# EAGLE design AstroEQ SMD V4.8 (EAGLE 6.6.0)
REVISION: V4.8
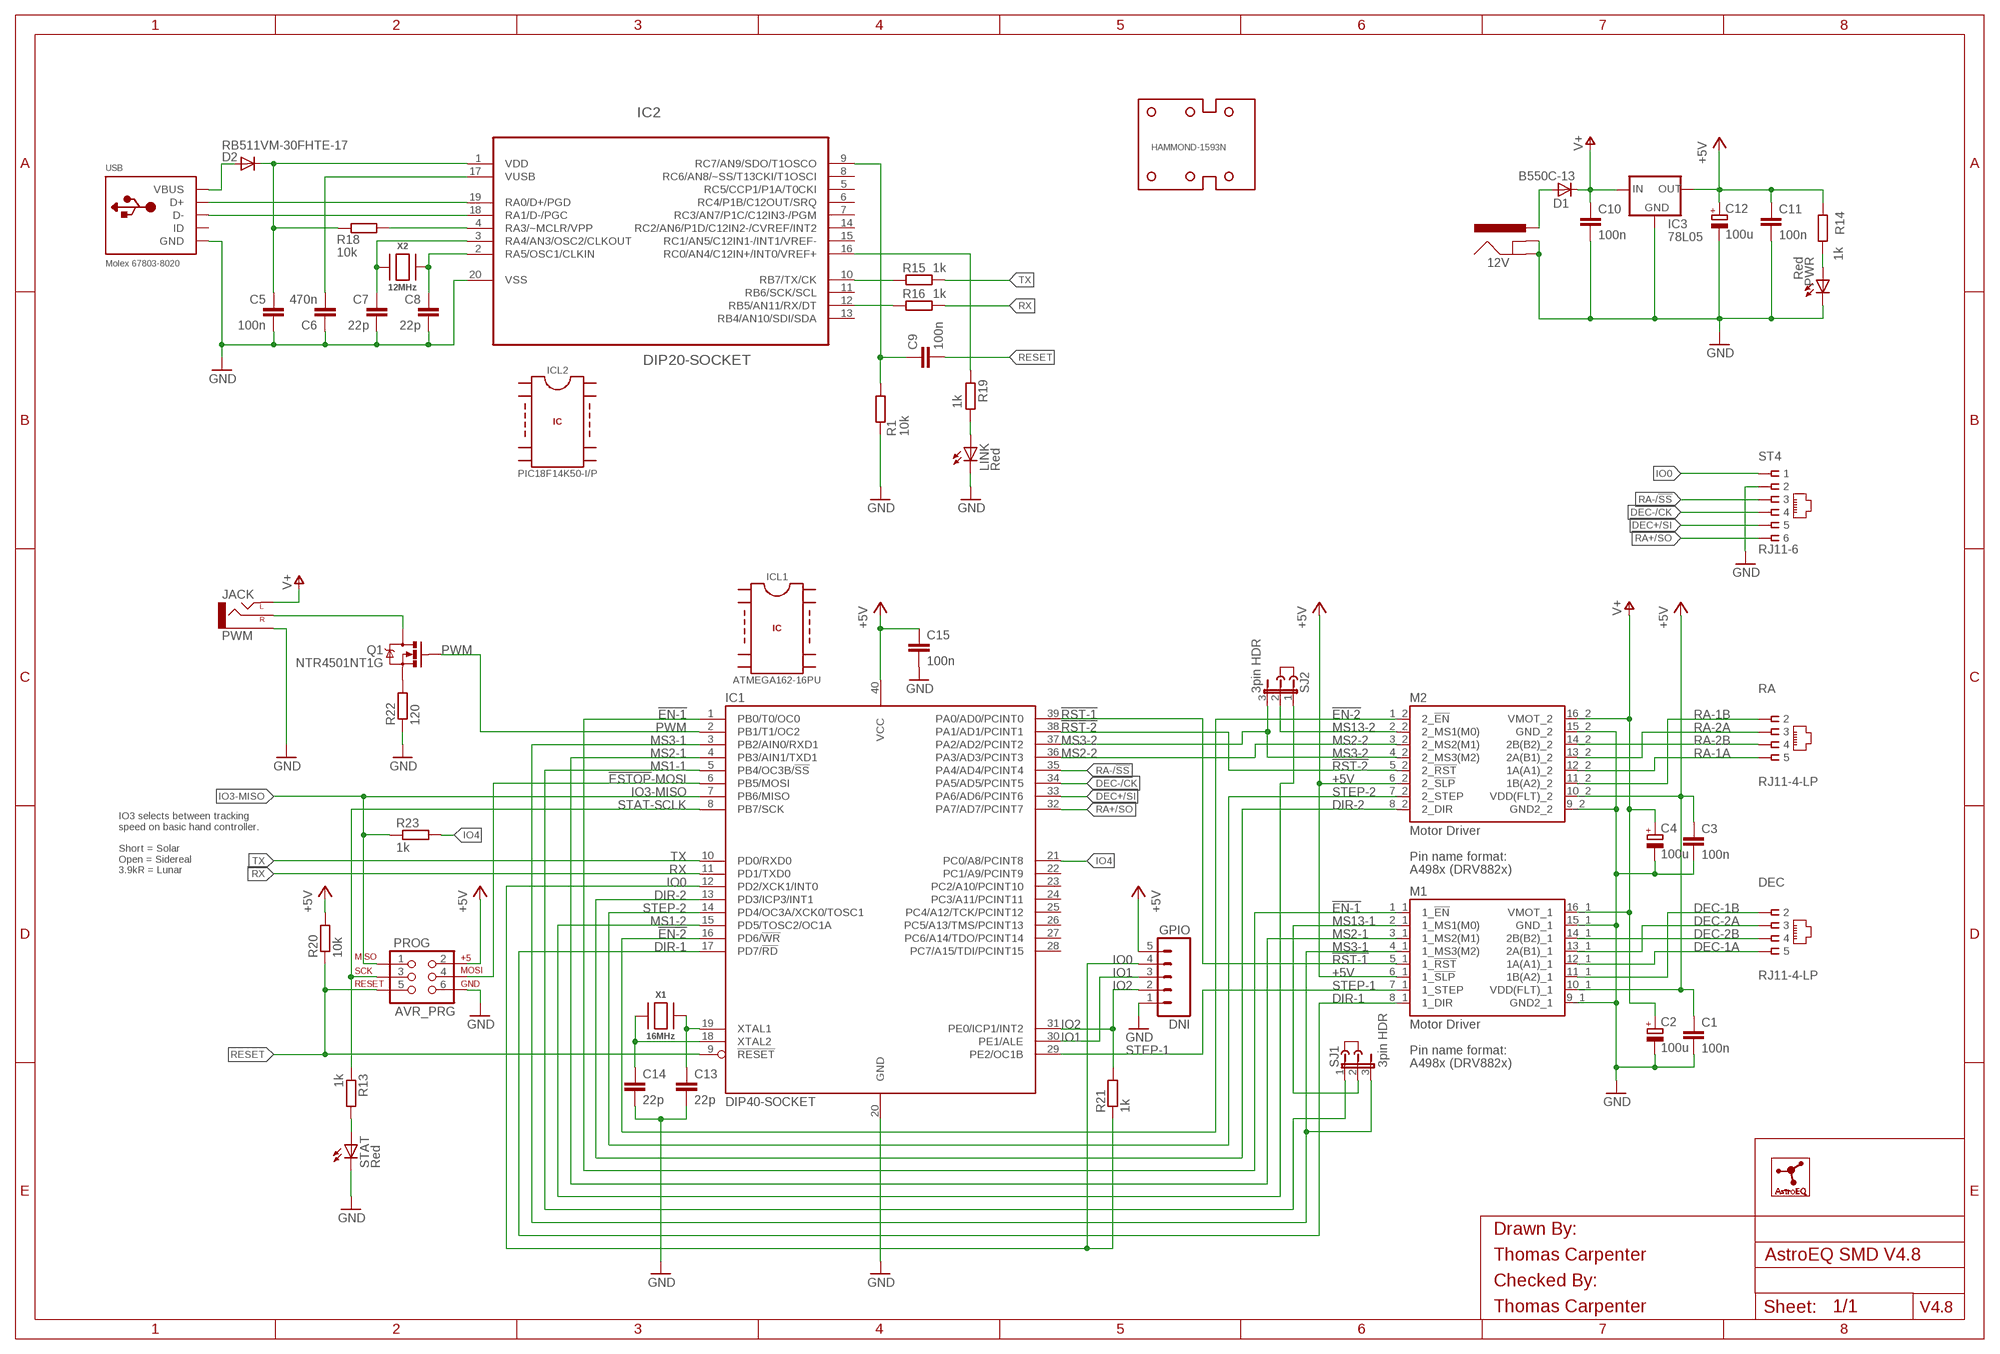
[diagram p0: schematic, sheet 1]
FRAME1 (A3L-LOC): CHECKED_BY: Thomas Carpenter; DRAWN_BY: Thomas Carpenter

## Parts
12V  POWER_JACKPTH  [POWER_JACK_PTH]
C1  100n  C-EUC0603  [C0603]
C2  100u  CPOL-EUD  [PANASONIC_D]
C3  100n  C-EUC0603  [C0603]
C4  100u  CPOL-EUD  [PANASONIC_D]
C5  100n  C-EUC0603  [C0603]
C6  470n  C-EUC0603  [C0603]
C7  22p  C-EUC0603  [C0603]
C8  22p  C-EUC0603  [C0603]
C9  100n  C-EUC0603  [C0603]
C10  100n  C-EUC0603  [C0603]
C11  100n  C-EUC0603  [C0603]
C12  100u  CPOL-EUD  [PANASONIC_D]
C13  22p  C-EUC0603  [C0603]
C14  22p  C-EUC0603  [C0603]
C15  100n  C-EUC0603  [C0603]
D1  B550C-13  DIODE-SMC  [SMC]
D2  RB511VM-30FHTE-17  DIODESOD  [SOD-323]
DEC  RJ11-4-LP  [RJ11-NO_SHIELD-4-LP]
GPIO  DNI  M05PTH  [1X05]
HAMMOND-1593N  HAMMOND-1593N-4HOLE  [HAMMOND-1593N4HOLES]
IC1  DIP40-SOCKET  ATMEGA162-16PU  [DIL40]
IC2  DIP20-SOCKET  PIC18F14K50-I/P-SKT  [DIL20-SKT]
IC3  78L05  V_REG_78XX-SOT89  [SOT89]
ICL1  ATMEGA162-16PU  IC  [IC]
ICL2  PIC18F14K50-I/P  IC  [IC]
J2  DNI  JUMPER  [JUMP]
J3  DNI  JUMPER  [JUMP]
LINK  Red  LED-1206-SIDE  [SML1206-SIDE]
LOGO1  DNI  ASTROEQ5MM  [ASTROEQ-SMALL]
M1  Motor Driver  A4983-DUAL-HV  [CARRIER-HV-DUAL]
M2  Motor Driver  A4983-DUAL-LV  [CARRIER-LV-DUAL]
PROG  AVR_PRG  AVR_SPI_PRG_6PTH  [2X3]
PWM  JACK  AUDIO-JACKPTH  [AUDIO-JACK]
PWR  Red  LED-1206-SIDE  [SML1206-SIDE]
Q1  NTR4501NT1G  MOSFET-NCHANNELSMD  [SOT23-3]
R1  10k  R-EU_R0603  [R0603]
R13  1k  R-EU_R0603  [R0603]
R14  1k  R-EU_R0603  [R0603]
R15  1k  R-EU_R0603  [R0603]
R16  1k  R-EU_R0603  [R0603]
R18  10k  R-EU_R0603  [R0603]
R19  1k  R-EU_R0603  [R0603]
R20  10k  R-EU_R0603  [R0603]
R21  1k  R-EU_R0603  [R0603]
R22  120  R-EU_R0805  [R0805]
R23  1k  R-EU_R0603  [R0603]
RA  RJ11-4-LP  [RJ11-NO_SHIELD-4-LP]
SJ1  3pin HDR  JP2E  [JP2]
SJ2  3pin HDR  JP2E  [JP2]
ST4  RJ11-6  RJ11-LP  [RJ11-NO_SHIELD-LP]
STAT  Red  LED-1206-SIDE  [SML1206-SIDE]
USB  Molex 67803-8020  USBMINIAB  [USB-MINIAB]
X1  16MHz  XTALNX5032  [NX5032]
X2  12MHz  XTALNX5032  [NX5032]

## Nets
!EN-1: IC1.1(PB0/T0/OC0) M2.1_1(1_!EN)
!EN-2: IC1.16(PD6/!WR) M2.1_2(2_!EN)
!ESTOP!-MOSI: IC1.6(PB5/MOSI) PROG.4
!RST-1: IC1.39(PA0/AD0/PCINT0) M2.5_1(1_!RST)
!RST-2: IC1.38(PA1/AD1/PCINT1) M2.5_2(2_!RST)
+5V: C1.1 C3.1 C11.1 C12.+ C15.1 GPIO.5 IC1.40(VCC) IC3.1(OUT) M1.10_1(VDD(FLT)_1) M1.10_2(VDD(FLT)_2) M2.6_1(1_!SLP) M2.6_2(2_!SLP) PROG.2 R14.1 R20.2
AVROSC1: C13.1 IC1.19(XTAL1) X1.P$2
AVROSC2: C14.1 IC1.18(XTAL2) X1.P$1
D_N [usbdat]: IC2.18(RA1/D-/PGC) USB.D-
D_P [usbdat]: IC2.19(RA0/D+/PGD) USB.D+
DEC+/SI: IC1.33(PA6/AD6/PCINT6) ST4.5
DEC-1A: DEC.5 M1.12_1(1A(A1)_1)
DEC-1B: DEC.2 M1.11_1(1B(A2)_1)
DEC-2A: DEC.3 M1.13_1(2A(B1)_1)
DEC-2B: DEC.4 M1.14_1(2B(B2)_1)
DEC-/CK: IC1.34(PA5/AD5/PCINT5) ST4.4
DIR-1: IC1.17(PD7/!RD) M2.8_1(1_DIR)
DIR-2: IC1.13(PD3/ICP3/INT1) M2.8_2(2_DIR)
DTR: C9.1 IC2.9(RC7/AN9/SDO/T1OSCO) R1.1
GND: 12V.GND 12V.GNDBREAK C1.2 C2.- C3.2 C4.- C5.2 C6.1 C7.2 C8.2 C10.2 C11.2 C12.- C13.2 C14.2 C15.2 GPIO.1 IC1.20(GND) IC2.20(VSS) IC3.2(GND) IC3.4(GND) LINK.C LINK.E(C) M1.9_1(GND2_1) M1.9_2(GND2_2) M1.15_1(GND_1) M1.15_2(GND_2) PROG.6 PWM.SLEEVE PWR.C PWR.E(C) R1.2 R22.1 ST4.2 STAT.C STAT.E(C) USB.GND USB.GND1(GND) USB.GND2(GND) USB.GND3(GND) USB.GND4(GND)
IO0: GPIO.4 IC1.12(PD2/XCK1/INT0) R21.1 ST4.1
IO1: GPIO.3 IC1.30(PE1/ALE)
IO2: GPIO.2 IC1.31(PE0/ICP1/INT2) R21.2
IO3-MISO: IC1.7(PB6/MISO) PROG.1 R23.1
IO4: IC1.21(PC0/A8/PCINT8) R23.2
MCLR: IC2.4(RA3/~MCLR/VPP) R18.1
MS1-1: IC1.5(PB4/OC3B/!SS) SJ1.1
MS1-2: IC1.15(PD5/TOSC2/OC1A) SJ2.1
MS2-1: IC1.4(PB3/AIN1/TXD1) M2.3_1(1_MS2(M1))
MS2-2: IC1.36(PA3/AD3/PCINT3) M2.3_2(2_MS2(M1))
MS3-1: IC1.3(PB2/AIN0/RXD1) M2.4_1(1_MS3(M2)) SJ1.3
MS3-2: IC1.37(PA2/AD2/PCINT2) M2.4_2(2_MS3(M2)) SJ2.3
MS13-1: M2.2_1(1_MS1(M0)) SJ1.2
MS13-2: M2.2_2(2_MS1(M0)) SJ2.2
PWM: IC1.2(PB1/T1/OC2) Q1.1(G)
PWM-ILIM: Q1.2(S) R22.2
PWM-OD: PWM.RING(RIGHT) Q1.3(D)
PWRLED: PWR.A R14.2
RA+/SO: IC1.32(PA7/AD7/PCINT7) ST4.6
RA-1A: M1.12_2(1A(A1)_2) RA.5
RA-1B: M1.11_2(1B(A2)_2) RA.2
RA-2A: M1.13_2(2A(B1)_2) RA.3
RA-2B: M1.14_2(2B(B2)_2) RA.4
RA-/!SS: IC1.35(PA4/AD4/PCINT4) ST4.3
RESET: C9.2 IC1.9(!RESET) PROG.5 R20.1
RX: IC1.11(PD1/TXD0) R16.1
RX(USB): IC2.12(RB5/AN11/RX/DT) R16.2
STAT-SCLK: IC1.8(PB7/SCK) PROG.3 R13.1
STATLED: R13.2 STAT.A
STEP-1: IC1.29(PE2/OC1B) M2.7_1(1_STEP)
STEP-2: IC1.14(PD4/OC3A/XCK0/TOSC1) M2.7_2(2_STEP)
TX: IC1.10(PD0/RXD0) R15.1
TX(USB): IC2.10(RB7/TX/CK) R15.2
USBLED: LINK.A R19.1
USBOSC1: C8.1 IC2.2(RA5/OSC1/CLKIN) X2.P$2
USBOSC2: C7.1 IC2.3(RA4/AN3/OSC2/CLKOUT) X2.P$1
USBSTAT: IC2.16(RC0/AN4/C12IN+/INT0/VREF+) R19.2
V+: C2.+ C4.+ C10.1 D1.C IC3.3(IN) M1.16_1(VMOT_1) M1.16_2(VMOT_2) PWM.TIP(LEFT)
VBUS: D2.2(A) USB.VBUS
VIN: 12V.PWR D1.A
VPIC: C5.1 D2.1(C) IC2.1(VDD) R18.2
VUSB: C6.2 IC2.17(VUSB)
Unconnected: IC1.22(PC1/A9/PCINT9) IC1.23(PC2/A10/PCINT10) IC1.24(PC3/A11/PCINT11) IC1.25(PC4/A12/TCK/PCINT12) IC1.26(PC5/A13/TMS/PCINT13) IC1.27(PC6/A14/TDO/PCINT14) IC1.28(PC7/A15/TDI/PCINT15) IC2.5(RC5/CCP1/P1A/T0CKI) IC2.6(RC4/P1B/C12OUT/SRQ) IC2.7(RC3/AN7/P1C/C12IN3-/PGM) IC2.8(RC6/AN8/~SS/T13CKI/T1OSCI) IC2.11(RB6/SCK/SCL) IC2.13(RB4/AN10/SDI/SDA) IC2.14(RC2/AN6/P1D/C12IN2-/CVREF/INT2) IC2.15(RC1/AN5/C12IN1-/INT1/VREF-) USB.ID

## Notes on the sheet
- IO3 selects between tracking
  speed on basic hand controller.
  
  Short = Solar
  Open = Sidereal
  3.9kR = Lunar

## Library data of the parts
12V = SparkFun:POWER_JACK: Power Jack This is the standard 5.5mm barrel jack for power. The PTH is the most common, proven, reliable, footprint. All others are experimental. The Slot footprint only works if the mill layer is transmitted to the PCB fab house so be warned. Spark Fun Electronics SKU : PRT-00119. Mating wall wart : TOL-00298 (and others); MF: MULTICOMP; MPN: MJ-179PH; OC_FARNELL: 1737246
C1 C3 C5 C9-C11 C15 = rcl:C-EU: CAPACITOR, European symbol; MF: MULTICOMP; MPN: MC0603F104Z250CT; OC_FARNELL: 1759038
C2 C4 C12 = rcl:CPOL-EU: POLARIZED CAPACITOR, European symbol; MF: WURTH ELEKTRONIK; MPN: 865080545012; OC_FARNELL: 2466321
C6 = rcl:C-EU: CAPACITOR, European symbol; MF: MULTICOMP; MPN: MC0603F474Z160CT; OC_FARNELL: 1759021
C7 C8 C13 C14 = rcl:C-EU: CAPACITOR, European symbol; MF: MULTICOMP; MPN: MC0603N220J500CT; OC_FARNELL: 1759057
D1 = diode:DIODE-: DIODE; MF: DIODES INC.; MPN: B550C-13-F; OC_FARNELL: 1858608
D2 = SparkFun:DIODE: Diode These are standard reverse protection diodes and small signal diodes. SMA package can handle up to about 1A. SOD-323 can handle about 200mA. What the SOD-323 package when ordering, there are some mfgs out there that are 5-pin packages.; MF: ROHM; MPN: RB511VM-30FHTE-17; OC_FARNELL: 2581544
DEC RA = con-tycoelectronics:RJ11-4; MF: MOLEX; MPN: 95501-2641; OC_FARNELL: 1560166
GPIO = SparkFun:M05: Header 5 Standard 5-pin 0.1" header. Use with straight break away headers (SKU : PRT-00116), right angle break away headers (PRT-00553), swiss pins (PRT-00743), machine pins (PRT-00117), and female headers (PRT-00115). Molex polarized connector foot print use with SKU : PRT-08230 with associated crimp pins and housings.; OC_FARNELL: unknown
HAMMOND-1593N = holes:HAMMOND-1593N; MF: HAMMOND; MPN: 1593NBK; OC_FARNELL: 9287566
IC1 = atmel:ATMEGA162: 8-bit RISC MICROCONTROLLER 16K Bytes internal flash program memory 1K Bytes internal SRAM Upto 64K Bytes optional external memory space 512 Bytes EEPROM Two 8-bit timers Two 16-bit timers Dual programmable serial USARTs Master/Slave serial SPI interface Source: ATMEGA162_DIP40.lbr; MF: MULTICOMP; MPN: 2227MC-40-06-05-F1; OC_FARNELL: 1103855
IC2 = microchip:PIC18F14K50: USB Flash Microcontrollers; MF: MULTICOMP
IC3 = SparkFun:V_REG_78XX: Voltage Regulator Standard 7805 5V regulator. IGO (Input Ground Output). Spark Fun Electronics SKU : COM-00107; MF: STMICROELECTRONICS; MPN: L78L05ACUTR; OC_FARNELL: 1366573
ICL1 = ic-package:IC; MF: ATMEL; MPN: ATMEGA162-16PU; OC_FARNELL: 9171169
ICL2 = ic-package:IC; MF: MICROCHIP; MPN: PIC18F14K50-I/P; OC_FARNELL: 1648501
J2 J3 = jumper:JUMPER: JUMPER header; MF: 3M; MPN: 969102-0000-DA; OC_FARNELL: 2579814
LINK PWR STAT = led:LED: LED OSRAM: - CHIPLED LG R971, LG N971, LY N971, LG Q971, LY Q971, LO R971, LY R971 LH N974, LH R974 LS Q976, LO Q976, LY Q976 LO Q996 - Hyper CHIPLED LW Q18S LB Q993, LB Q99A, LB R99A - SideLED LS A670, LO A670, LY A670, LG A670, LP A670 LB A673, LV A673, LT A673, LW A673 LH A674 LY A675 LS A676, LA A676, LO A676, LY A676, LW A676 LS A679, LY A679, LG A679 - Hyper Micro SIDELED® LS Y876, LA Y876, LO Y876, LY Y876 LT Y87S - SmartLED LW L88C, LW L88S LB L89C, LB L89S, LG L890 LS L89K, LO L89K, LY L89K LS L896, LA L896, LO L896, LY L896 - TOPLED LS T670, LO T670, LY T670, LG T670, LP T670 LSG T670, LSP T670, LSY T670, LOP T670, LYG T670 LG T671, LOG T671, LSG T671 LB T673, LV T673, LT T673, LW T673 LH T674 LS T676, LA T676, LO T676, LY T676, LB T676, LH T676, LSB T676, LW T676 LB T67C, LV T67C, LT T67C, LS T67K, LO T67K, LY T67K, LW E67C LS E67B, LA E67B, LO E67B, LY E67B, LB E67C, LV E67C, LT E67C LW T67C LS T679, LY T679, LG T679 LS T770, LO T770, LY T770, LG T770, LP T770 LB T773, LV T773, LT T773, LW T773 LH T774 LS E675, LA E675, LY E675, LS T675 LS T776, LA T776, LO T776, LY T776, LB T776 LHGB T686 LT T68C, LB T68C - Hyper Mini TOPLED® LB M676 - Mini TOPLED Santana® LG M470 LS M47K, LO M47K, LY M47K Source: http://www.osram.convergy.de LUXEON: - LUMILED® LXK2-PW12-R00, LXK2-PW12-S00, LXK2-PW14-U00, LXK2-PW14-V00 LXK2-PM12-R00, LXK2-PM12-S00, LXK2-PM14-U00 LXK2-PE12-Q00, LXK2-PE12-R00, LXK2-PE12-S00, LXK2-PE14-T00, LXK2-PE14-U00 LXK2-PB12-K00, LXK2-PB12-L00, LXK2-PB12-M00, LXK2-PB14-N00, LXK2-PB14-P00, LXK2-PB14-Q00 LXK2-PR12-L00, LXK2-PR12-M00, LXK2-PR14-Q00, LXK2-PR14-R00 LXK2-PD12-Q00, LXK2-PD12-R00, LXK2-PD12-S00 LXK2-PH12-R00, LXK2-PH12-S00 LXK2-PL12-P00, LXK2-PL12-Q00, LXK2-PL12-R00 Source: www.luxeon.com KINGBRIGHT: KA-3528ASYC Source: www.kingbright.com; MF: WURTH ELEKTRONIK; MPN: 155124RS73200; OC_FARNELL: 2322101
LOGO1 = CompanyLogos:ASTROEQ; OC_FARNELL: unknown
M1 = A4983Carrier:A4983-DUAL-HV; MF: SAMTEC; MPN: CES-116-01-T-S; OC_FARNELL: 1667522
M2 = A4983Carrier:A4983-DUAL-LV; MF: SAMTEC; MPN: CES-116-01-T-S; OC_FARNELL: 1667522
PROG = SparkFun:AVR_SPI_PRG_6: AVR ISP 6 Pin This is the reduced ISP connector for AVR programming. Common on Arduino. This footprint will take up less PCB space and can be used with a 10-pin to 6-pin adapter such as SKU: BOB-08508; MF: HARWIN; MPN: M20-9980346; OC_FARNELL: 1022231
PWM = SparkFun:AUDIO-JACK: 3.5mm Audio Jack Simple 3.5mm common PCB mount audio jack. SKU: PRT-08032; MF: CLIFF ELECTRONIC COMPONENTS; MPN: FC68131; OC_FARNELL: 2518188
Q1 = SparkFun:MOSFET-NCHANNEL; MF: ON SEMICONDUCTOR; MPN: NTR4501NT1G; OC_FARNELL: 1431305
R1 R18 R20 = rcl:R-EU_: RESISTOR, European symbol; MF: MULTICOMP; MPN: MCWR06X1002FTL; OC_FARNELL: 2447230
R13-R16 R19 R21 R23 = rcl:R-EU_: RESISTOR, European symbol; MF: MULTICOMP; MPN: MCWR06X1001FTL; OC_FARNELL: 2447272
R22 = rcl:R-EU_: RESISTOR, European symbol; MF: MULTICOMP; MPN: MCWR08X1200FTL; OC_FARNELL: 2447561
SJ1 SJ2 = jumper:JP2E: JUMPER; MF: HARWIN; MPN: M20-9990345.; OC_FARNELL: 1022248
ST4 = con-tycoelectronics:RJ11: CORCOM Modular RJ Jacks No Shield Source: www.tycoelectronics.com .. ENG_DS_1654001_1099_RJ_L_0507.pdf; MF: MOLEX; MPN: 95501-2661; OC_FARNELL: 1536490
USB = adafruit:USB: USB Connectors USBMINIB - Surface Mount Female Mini-B USB Connector 4UConnector: 06564 By microbuilder.eu Thru-hole RA Female Mini-B USB Connector 4UConnector: 18732 By ladyada.net; MF: MOLEX; MPN: 67803-8020; OC_FARNELL: 1355761
X1 = adafruit:XTAL: Low cost SMT crystals, no capacitors included http://www.ladyada.net/library/eagle; MF: TXC; MPN: 7A-16.000MAAJ-T; OC_FARNELL: 1841946
X2 = adafruit:XTAL: Low cost SMT crystals, no capacitors included http://www.ladyada.net/library/eagle; MF: TXC; MPN: 7A-12.000MAAJ-T; OC_FARNELL: 1841940

## Net classes
1 power: width 0.61 mm, drill 0.711 mm, clearance 0.203 mm
2 gnd: width 0.305 mm, drill 0.711 mm, clearance 0.203 mm
3 usbvcc: width 0.508 mm, drill 0.711 mm, clearance 0.203 mm
4 usbdat: width 0.406 mm, clearance 0.152 mm

## Board
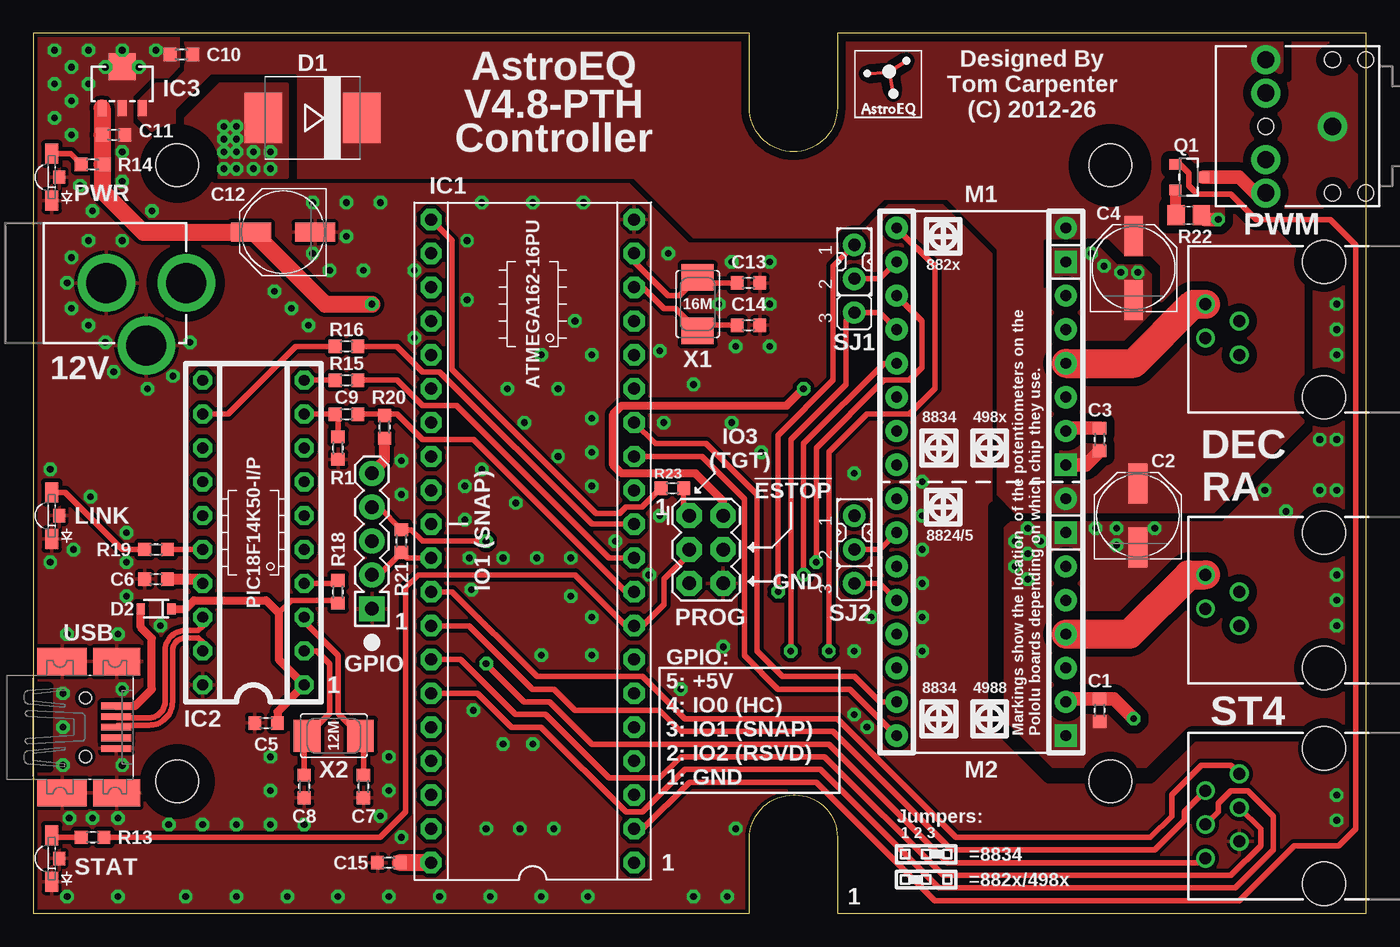
[diagram p1: board, top side]
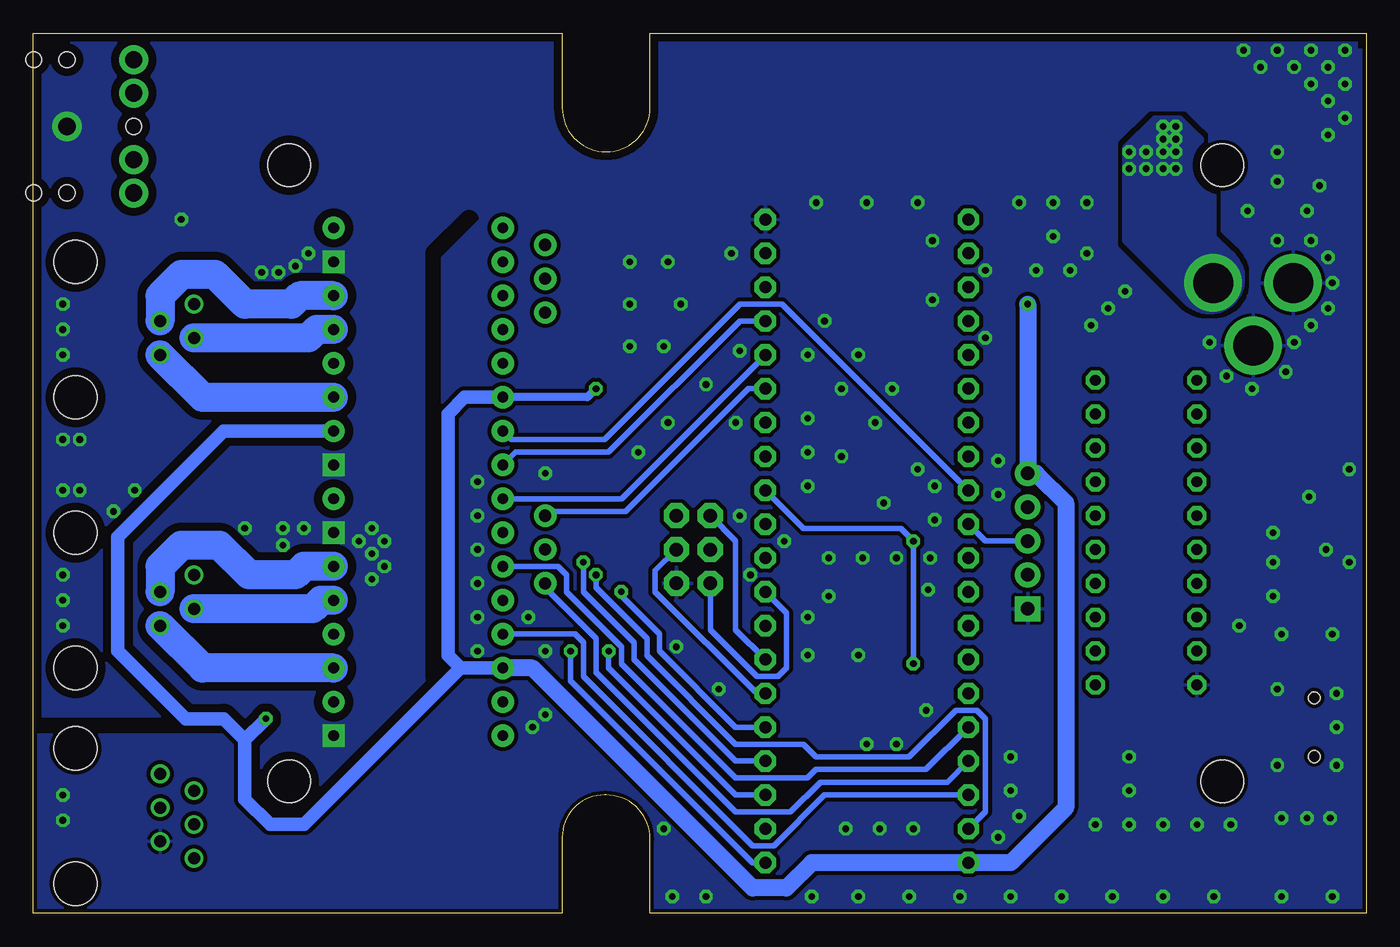
[diagram p2: board, bottom side, seen from below]

Size 100 x 66.04 mm. Coordinates in mm from the lower left corner, seen from the top.
Outline: 57.02,8.89 57.15,8.89
Copper layers (1*16): Top 0.035mm / dielectric 1.5mm / Bottom 0.035mm
Design rules "pcbtrain *": minimum track width 0.2mm, minimum drill 0.4mm, track to track 6mil, track to pad 6mil, pad to pad 6mil, via to via 6mil, smd to smd 0mil, copper to edge 10mil, drill to drill 0.2mm, minimum pad ring 10mil, minimum via ring 10mil, stop-mask expansion 0.125mm, vias tented up to drill 0.75mm, thermal gap 10mil
tKeepout: area 78.3,7.4 to 83.3,12.4; area 78.3,53.6 to 83.3,58.6; area 8.3,7.4 to 13.3,12.4; area 8.3,53.6 to 13.3,58.6
bKeepout: area 78.3,7.4 to 83.3,12.4; area 78.3,53.6 to 83.3,58.6; area 8.3,7.4 to 13.3,12.4; area 8.3,53.6 to 13.3,58.6
tRestrict: area 78.3,53.6 to 83.3,58.6; area 8.3,7.4 to 13.3,12.4; area 8.3,53.6 to 13.3,58.6; area 9,44.8 to 13.9,49.8; 7 lines
bRestrict: 3 lines

### Footprints (pad centres in the part's own frame; a part is rotated, then mirrored left to right if it is on the bottom)
POWER_JACK_PTH = drill 2.997 pad 4.318: GND 0,7.7; GNDBREAK 4.7,10.7; PWR 0,13.7
C0603 = smd 0.95 x 1: 1 -0.85,0; 2 0.85,0
PANASONIC_D = smd 3 x 1.4: + 2.4,0; - -2.4,0
SMC = smd 2.8 x 3.8: A 3.7,0; C -3.7,0
SOD-323 = smd 0.63 x 0.83: 1 -1.15,0; 2 1.15,0
RJ11-NO_SHIELD-4-LP = drill 0.9 pad 1.4: 2 -1.905,6.35; 3 -0.635,8.89; 4 0.635,6.35; 5 1.905,8.89 | hole 3.251: -5.08,0; 5.08,0
1X05 = drill 1.016 pad 1.88 square: 1 -5.08,0 | drill 1.016 pad 1.88: 2 -2.54,0; 3 0,0; 4 2.54,0; 5 5.08,0
HAMMOND-1593N4HOLES = hole 3.2: 10.795,9.906; 10.795,56.134; 80.797,9.906; 80.797,56.134
DIL40 = drill 0.9 pad 1.6 octagon: 1 -24.13,-7.62; 2 -21.59,-7.62; 3 -19.05,-7.62; 4 -16.51,-7.62; 5 -13.97,-7.62; 6 -11.43,-7.62; 7 -8.89,-7.62; 8 -6.35,-7.62; 9 -3.81,-7.62; 10 -1.27,-7.62; 11 1.27,-7.62; 12 3.81,-7.62; 13 6.35,-7.62; 14 8.89,-7.62; 15 11.43,-7.62; 16 13.97,-7.62; 17 16.51,-7.62; 18 19.05,-7.62; 19 21.59,-7.62; 20 24.13,-7.62; 21 24.13,7.62; 22 21.59,7.62; 23 19.05,7.62; 24 16.51,7.62; 25 13.97,7.62; 26 11.43,7.62; 27 8.89,7.62; 28 6.35,7.62; 29 3.81,7.62; 30 1.27,7.62; 31 -1.27,7.62; 32 -3.81,7.62; 33 -6.35,7.62; 34 -8.89,7.62; 35 -11.43,7.62; 36 -13.97,7.62; 37 -16.51,7.62; 38 -19.05,7.62; 39 -21.59,7.62; 40 -24.13,7.62
DIL20-SKT = drill 0.813 pad 1.422 octagon: 1 -3.81,11.43; 2 -3.81,8.89; 3 -3.81,6.35; 4 -3.81,3.81; 5 -3.81,1.27; 6 -3.81,-1.27; 7 -3.81,-3.81; 8 -3.81,-6.35; 9 -3.81,-8.89; 10 -3.81,-11.43; 11 3.81,-11.43; 12 3.81,-8.89; 13 3.81,-6.35; 14 3.81,-3.81; 15 3.81,-1.27; 16 3.81,1.27; 17 3.81,3.81; 18 3.81,6.35; 19 3.81,8.89; 20 3.81,11.43
SOT89 = smd 0.65 x 1.2: 1 -1.5,-1.8; 2 0,-1.8; 3 1.5,-1.8 | smd 2 x 2: 4 0,1.3
SML1206-SIDE = smd 1.5 x 1: A 1.75,0; C -1.75,0 | smd 1 x 0.9: E 0,-0.55
CARRIER-HV-DUAL = drill 0.813 pad 1.676 square: 9_1 -1.27,0; 9_2 19.05,0; 15_1 -16.51,0; 15_2 3.81,0 | drill 0.813 pad 1.676: 10_1 -3.81,0; 10_2 16.51,0; 11_1 -6.35,0; 11_2 13.97,0; 12_1 -8.89,0; 12_2 11.43,0; 13_1 -11.43,0; 13_2 8.89,0; 14_1 -13.97,0; 14_2 6.35,0; 16_1 -19.05,0; 16_2 1.27,0
CARRIER-LV-DUAL = drill 0.813 pad 1.676: 1_1 -19.05,0; 1_2 1.27,0; 2_1 -16.51,0; 2_2 3.81,0; 3_1 -13.97,0; 3_2 6.35,0; 4_1 -11.43,0; 4_2 8.89,0; 5_1 -8.89,0; 5_2 11.43,0; 6_1 -6.35,0; 6_2 13.97,0; 7_1 -3.81,0; 7_2 16.51,0; 8_1 -1.27,0; 8_2 19.05,0
2X3 = drill 1.016 pad 1.88 octagon: 1 -2.54,-1.27; 2 -2.54,1.27; 3 0,-1.27; 4 0,1.27; 5 2.54,-1.27; 6 2.54,1.27
AUDIO-JACK = drill 1.3 pad 2.184: RING 5,5; RSH 5,2.5; SLEEVE 0,0; TIP 5,-5; TSH 5,-2.5 | hole 1.2: 0,5; -2.5,5; -2.5,-5; 0,-5; 5,0
SOT23-3 = smd 0.8 x 0.9: 1 -0.95,-1; 2 0.95,-1; 3 0,1.1
R0603 = smd 0.95 x 1: 1 -0.85,0; 2 0.85,0
R0805 = smd 1.3 x 1.5: 1 -0.95,0; 2 0.95,0
JP2 = drill 0.914 pad 1.676: 1 -2.54,0; 2 0,0; 3 2.54,0
RJ11-NO_SHIELD-LP = drill 0.9 pad 1.4: 1 -3.175,8.89; 2 -1.905,6.35; 3 -0.635,8.89; 4 0.635,6.35; 5 1.905,8.89; 6 3.175,6.35 | hole 3.251: -5.08,0; 5.08,0
USB-MINIAB = smd 0.5 x 2.25: D+ 0,2.225; D- -0.8,2.225; GND 1.6,2.225; ID 0.8,2.225; VBUS -1.6,2.225 | smd 2.05 x 3.7: GND1 -4.925,-1.85; GND4 4.925,-1.85 | smd 2.05 x 3.5: GND2 -4.925,2.25; GND3 4.925,2.25 | hole 0.9: -2.2,-0.1; 2.2,-0.1
NX5032 = smd 2 x 2.4: P$1 2,0; P$2 -2,0

### Placement (x,y rotation side)
12V  -2.22,47.31 270 top
C1  80.01,15.24 270 top
C2  82.87,29.84 90 top
C3  80.01,35.56 270 top
C4  82.55,48.42 90 top
C5  17.46,14.29 180 top
C6  9.21,25.08 0 top
C7  24.77,9.53 270 top
C8  20.32,9.53 270 top
C9  23.5,37.47 0 top
C10  11.11,64.45 180 top
C11  6.03,58.42 0 top
C12  18.73,51.12 180 top
C13  53.66,47.31 0 top
C14  53.66,44.13 0 top
C15  26.67,3.81 180 top
D1  20.95,59.69 180 top
D2  9.21,22.86 180 top
DEC  96.84,43.81 90 top
GPIO  25.4,27.94 90 top
HAMMOND-1593N  0,0 0 top
IC1  37.47,27.94 90 top
IC2  16.51,28.57 180 top
IC3  6.67,62.23 0 top
ICL1  37.47,45.72 180 top
ICL2  16.51,28.57 180 top
J2  61.59,28.57 0 top
J3  61.59,48.9 0 top
LINK  1.38,29.84 90 top
LOGO1  61.59,59.69 0 top
M1  77.47,32.38 270 top
M2  64.77,32.38 270 top
PROG  50.48,27.3 270 top
PWM  97.47,59.05 180 top
PWR  1.38,55.24 90 top
Q1  86.68,55.24 270 top
R1  22.86,34.92 270 top
R13  4.45,5.71 180 top
R14  4.45,56.2 180 top
R15  23.5,40.01 180 top
R16  23.5,42.55 180 top
R18  22.86,24.13 270 top
R19  9.21,27.3 0 top
R20  26.35,36.51 270 top
R21  27.62,27.94 270 top
R22  86.68,52.39 180 top
R23  47.94,31.91 180 top
RA  96.84,23.5 90 top
SJ1  61.59,47.62 270 top
SJ2  61.59,27.3 270 top
ST4  96.84,7.3 90 top
STAT  1.38,4.13 90 top
USB  4,13.97 270 top
X1  49.85,45.72 270 top
X2  22.54,13.34 0 top

### Tracks (layer width: path | path; a pad name or v marks a point on that pad's centre or on a via)
!EN-1  (via drill 0.5)
  Top 0.406: M2.1_1 67.63,48.58 67.63,39.37 65.72,37.47 62.55,37.47 59.69,34.61 v59.69,19.68
  Bottom 0.406: IC1.1 46.04,3.81 59.69,17.46 v59.69,19.68
!EN-2
  Bottom 0.406: M2.1_2 55.88,31.11 IC1.16
!ESTOP!-MOSI
  Bottom 0.406: IC1.6 45.72,16.51 53.34,24.13 53.34,25.72 PROG.4
!RST-1  (via drill 0.5)
  Top 0.406: M2.5_1 63.82,41.27 57.78,35.24 v57.78,25.4
  Bottom 0.406: IC1.39 28.57,7.62 28.57,14.61 29.21,15.24 30.8,15.24 34.29,11.75 41.27,11.75 42.23,12.7 47.31,12.7 53.98,19.37 53.98,20.64 57.78,24.45 v57.78,25.4
!RST-2
  Bottom 0.406: IC1.38 40.64,8.89 44.45,5.08 46.04,5.08 58.74,17.78 58.74,20.32 59.37,20.95 M2.5_2
+5V  (via drill 0.5, 0.5 pad 0.25)
  Top 0.406: R14.1 5.17,56.2 | C11.1 5.17,58.42
  Top 0.6: PROG.2 51.75,30.96
  Top 0.61: 51.75,30.96 49.69,33.02 44.13,33.02 43.5,33.66 43.5,37.47 44.13,38.1 56.52,38.1 v57.78,39.37
  Top 0.813: GPIO.5 26.35,33.97 R20.2
  Top 1.016: M1.10_1 77.69,36.41 C3.1 | M1.10_2 77.69,16.09 C1.1 81.06,16.09 v82.55,14.61
  Top 1.27: IC3.1 5.17,58.42 5.17,56.2 5.17,54.2 8.26,51.12 C12.+ 16.51,51.12 21.91,45.72 v25.4,45.72 | IC1.40 C15.1
  Bottom 0.61: v57.78,39.37 58.42,38.73 M2.6_1
  Bottom 1.016: M1.10_1 85.72,36.2 93.66,28.26 93.66,19.68 88.58,14.61 85.72,14.61 84.14,13.02 | v82.55,14.61 84.14,13.02 | 84.14,13.02 84.14,8.57 82.23,6.67 79.69,6.67 67.94,18.41 | 67.94,18.41 M2.6_2 | 67.94,18.41 68.9,19.37 68.9,37.47 67.63,38.73 M2.6_1
  Bottom 1.27: v25.4,45.72 GPIO.5 24.77,33.02 22.54,30.8 22.54,7.94 26.67,3.81 IC1.40 41.59,3.81 43.5,1.91 46.04,1.91 62.55,18.41 M2.6_2
AVROSC1
  Top 0.406: IC1.19 45.09,48.9 47.62,46.35 48.48,46.35 X1.P$2 50.26,47.31 C13.1
AVROSC2
  Top 0.406: IC1.18 45.72,46.99 47.31,45.4 48.16,45.4 X1.P$1 50.26,44.13 C14.1
D_N
  Top 0.406: IC2.18 12.7,21.55 12.38,21.23 11.43,21.23 arc90 9.88,19.68 9.88,15.88 arc-90 8.69,14.68 6.32,14.68 USB.D-
D_P
  Top 0.406: IC2.19 12.7,20.36 12.38,20.68 11.43,20.68 arc90 10.44,19.68 10.44,15.88 arc-90 8.69,14.12 6.38,14.12 USB.D+
DEC+/SI
  Top 0.406: IC1.33 32.7,21.59 37.47,16.83 39.05,16.83 40.64,15.24 46.99,15.24 48.58,13.65 60.01,13.65 68.9,4.76 84.14,4.76 86.36,6.99 86.36,7.62 ST4.5
DEC-1A
  Top 2.184: M1.12_1 82.55,41.27 87,45.72 DEC.5
DEC-1B
  Bottom 2.184: DEC.2 87.31,38.73 M1.11_1
DEC-2A
  Bottom 2.184: M1.13_1 78.74,43.81 79.38,43.18 DEC.3
DEC-2B
  Bottom 2.184: M1.14_1 80.01,46.35 80.64,45.72 84.14,45.72 86.36,47.94 88.9,47.94 90.49,46.35 DEC.4
DEC-/CK
  Top 0.406: IC1.34 32.07,19.05 36.2,14.92 38.42,14.92 43.18,10.16 46.99,10.16 48.58,11.75 59.37,11.75 68.26,2.86 89.85,2.86 92.08,5.08 92.08,6.35 ST4.4
DIR-1
  Bottom 0.406: IC1.17 46.99,44.45 56.83,34.61 63.82,34.61 M2.8_1
DIR-2
  Top 0.406: M2.8_2 61.28,16.83 55.88,16.83 53.34,19.37 53.34,31.11 50.16,34.29 IC1.13
DTR
  Top 0.406: IC2.9 C9.1 22.86,37.25 R1.1
GND  (via drill 0.5)
  Top 1.016: C3.2 78.95,33.66 M1.9_1 | v88.9,52.07 87.94,52.07 R22.1
  other vias: 6.67,57.15 6.67,54.93 8.89,52.7 1.59,64.77 6.67,64.77 4.13,64.77 1.59,62.23 4.13,62.23 1.59,59.69 2.86,60.96 2.86,63.5 5.4,63.5 4.45,52.7 6.67,50.48 3.49,54.61 7.94,63.5 9.21,64.77 2.86,58.42 79.38,49.53 82.87,48.1 81.6,48.1 80.33,48.58 79.69,28.89 81.28,28.89 84.14,28.89 81.28,27.62 96.52,35.56 97.79,35.56 96.52,31.75 97.79,31.75 97.79,45.72 97.79,41.91 97.79,43.81 97.79,23.5 97.79,21.59 97.79,25.4 97.79,8.89 97.79,6.99 74.61,28.89 74.61,26.99 74.61,25.08 73.66,27.94 73.66,26.04 75.56,27.94 92.39,31.75 93.98,30.16 2.22,16.51 2.22,11.11 2.22,13.97 6.67,16.83 6.67,11.11 2.7,7.14 6.35,7.14 6.35,20.95 2.54,20.95 9.53,21.59 6.99,26.35 6.99,23.81 4.29,31.27 6.99,28.57 1.27,33.34 1.27,26.35 3.02,27.3 2.54,1.27 6.35,1.27 11.43,1.27 15.24,1.27 19.05,1.27 22.86,1.27 26.67,1.27 30.48,1.27 34.29,1.27 38.1,1.27 41.59,1.27 49.53,1.27 52.07,1.27 4.13,50.48 2.86,49.21 2.86,45.4 4.13,44.13 5.4,42.86 11.75,42.86 10.48,40.32 8.57,39.37 6.03,40.64 2.54,47.31 20.64,44.13 19.37,45.4 18.1,46.67 20.95,49.53 22.23,48.26 24.77,48.26 20.95,53.34 23.5,53.34 23.5,50.8 26.04,53.34 33.66,53.34 37.47,53.34 41.27,53.34 47.62,49.53 51.44,45.72 55.24,45.72 55.24,48.9 55.24,42.55 52.7,42.55 52.39,48.9 20.32,6.67 17.78,9.21 17.78,11.75 26.67,11.75 26.67,9.21 27.62,5.71 4.45,7.14 17.78,6.67 15.24,6.67 12.7,6.67 10.16,6.67 26.04,7.3 36.83,36.83 39.37,39.37 35.56,39.37 38.1,41.91 40.64,44.45 41.91,41.91 33.02,15.24 35.24,12.7 37.47,12.7 61.59,14.92 61.59,19.68 62.55,13.97 66.67,19.68 66.67,22.23 66.67,24.77 66.67,27.3 66.67,29.84 66.67,32.38 62.87,22.23 33.97,6.35 36.51,6.35 39.05,6.35 54.61,34.61 52.39,36.83 49.53,39.69 46.99,42.23 61.59,33.02 48.58,16.83 51.75,20 41.91,32.07 41.91,34.61 41.91,37.15 47.31,36.83 32.86,24.29 40.32,23.81 38.1,19.37 41.91,19.37 41.91,22.23 27.62,33.97 27.62,31.43 35.24,26.67 40.32,26.67 32.38,29.53 32.38,32.07 33.66,33.34 36.2,30.8 39.37,34.29 37.78,26.67 32.7,26.67 46.2,25.4 52.7,6.35 28.57,43.18 32.54,46.04 28.57,48.26 32.54,50.48 46.99,29.84 43.66,27.94
  pour Top (isolate 0.305, rank 3): -1.27,66.99 72.07,66.99 72.07,14.29 76.2,10.16 82.55,10.16 87.63,15.24 102.3,15.24 102.3,-0.95 -1.27,-0.95
  pour Bottom (isolate 0.305, rank 3): -1.27,64.77 35.56,64.77 46.99,53.34 65.15,53.34 69.91,48.58 69.85,16.51 80.01,6.35 81.92,6.35 84.14,8.57 84.14,13.02 85.09,13.97 101.66,14.29 101.66,-0.95 -1.27,-0.95
  pour Top (isolate 0.305, rank 3, no thermals): -1.27,67.31 -1.27,57.47 11.43,57.47 11.43,67.31
  pour Top (isolate 0.61, rank 3, no thermals): 71.12,67.31 71.12,9.21 101.6,9.21 101.6,67.31
  pour Top (isolate 0.61, no thermals): 76.52,49.85 80.01,49.85 81.28,48.58 83.19,48.58 83.82,47.94 83.82,41.91 76.52,41.91
  pour Bottom (isolate 0.61, rank 3): -2.54,68.58 -2.54,-2.54 102.87,-2.54 102.87,68.58
  pour Bottom (isolate 0.61, rank 3, no thermals): 71.12,66.04 71.12,7.94 101.6,7.94 101.6,66.04
IO0  (via drill 0.5)
  Top 0.406: GPIO.4 25.93,30.48 R21.1 28.36,28.79 29.21,27.94 v33.97,27.94 | ST4.1 87.63,3.81 68.58,3.81 59.69,12.7 41.91,12.7 38.73,15.88 36.83,15.88 v33.97,18.73
  Bottom 0.406: v33.97,18.73 v33.97,27.94 34.92,28.89 42.23,28.89 IC1.12
IO1
  Bottom 0.406: IC1.30 28.57,27.94 GPIO.3
IO2
  Top 0.406: IC1.31 28.04,26.67 R21.2 25.93,25.4 GPIO.2
IO3-MISO
  Top 0.406: PROG.1 48.79,30.27 R23.1
  Bottom 0.406: IC1.7 47.31,21.27 47.31,27.94 PROG.1
IO4
  Top 0.406: R23.2 45.66,30.48 44.45,30.48 43.97,30 42.23,30 31.43,40.8 31.43,50.48 IC1.21
MCLR
  Top 0.406: IC2.4 22.64,24.77 R18.1
MS1-1  (via drill 0.5)
  Top 0.406: v55.88,24.13 55.88,35.88 60.01,40.01 60.01,48.58 SJ1.1
  Bottom 0.406: IC1.5 47.31,13.97 53.02,19.68 53.02,20.95 55.88,23.81 v55.88,24.13
MS1-2
  Bottom 0.406: SJ2.1 61.28,30.16 55.56,30.16 46.35,39.37 IC1.15
MS2-1  (via drill 0.5)
  Top 0.406: v58.74,26.35 58.74,34.92 63.82,40.01 65.72,40.01 66.67,40.96 66.67,44.45 M2.3_1
  Bottom 0.406: IC1.4 47.31,11.43 54.93,19.05 54.93,20.32 58.74,24.13 v58.74,26.35
MS2-2
  Bottom 0.406: M2.3_2 60.64,26.04 60.01,25.4 60.01,24.13 55.88,20 55.88,18.73 47.31,10.16 41.91,10.16 41.27,10.79 33.02,10.79 IC1.36
MS3-1  (via drill 0.5)
  Top 0.406: M2.4_1 63.5,45.09 SJ1.3 60.96,44.45 60.96,39.69 56.83,35.56 v56.83,19.68
  Bottom 0.406: IC1.3 47.31,8.89 56.83,18.41 v56.83,19.68
MS3-2
  Top 0.406: M2.4_2 63.5,24.77 SJ2.3
  Bottom 0.406: IC1.37 31.43,9.84 40.96,9.84 43.18,7.62 47.31,7.62 57.78,18.1 57.78,20.64 61.59,24.45 SJ2.3
MS13-1
  Top 0.406: M2.2_1 63.5,47.62 SJ1.2
MS13-2
  Top 0.406: M2.2_2 63.5,27.3 SJ2.2
PWM
  Top 0.406: Q1.1 86.05,56.2 86.68,55.56 86.68,54.61 87.31,53.98 89.85,53.98 91.76,52.07 97.31,52.07 99.22,50.16 99.22,6.35 97.95,5.08 94.61,5.08 90.49,0.95 67.63,0.95 58.74,9.84 49.21,9.84 45.72,6.35 IC1.2
PWM-ILIM
  Top 0.406: 85.68,52.44 R22.2
  Top 0.813: Q1.2 85.68,52.44
PWM-OD
  Top 1.016: PWM.RING 91.68,54.05 90.49,55.24 Q1.3
PWRLED
  Top 0.406: PWR.A 2.8,56.99 R14.2
RA+/SO
  Top 0.406: IC1.32 31.43,24.13 37.78,17.78 45.72,17.78 48.9,14.61 60.33,14.61 69.22,5.71 83.82,5.71 85.41,7.3 85.41,8.89 87.63,11.11 89.85,11.11 ST4.6
RA-1A
  Top 2.184: M1.12_2 82.23,20.95 86.68,25.4 RA.5
RA-1B
  Bottom 2.184: M1.11_2 87.31,18.41 RA.2
RA-2A
  Bottom 2.184: M1.13_2 78.42,23.5 79.06,22.86 RA.3
RA-2B
  Bottom 2.184: M1.14_2 79.69,26.04 80.33,25.4 83.82,25.4 86.04,27.62 88.9,27.62 90.49,26.04 RA.4
RA-/!SS
  Top 0.406: IC1.35 33.34,16.51 35.88,13.97 38.1,13.97 44.45,7.62 45.72,7.62 48.9,10.79 59.05,10.79 67.94,1.91 90.17,1.91 93.03,4.76 93.03,7.3 91.12,9.21 89.85,9.21 88.9,8.26 88.9,7.62 ST4.3
RESET
  Top 0.406: C9.2 26.35,37.47 | 26.35,37.47 27.3,37.47 29.21,35.56 33.02,35.56 44.45,24.13 IC1.9 | R20.1 26.35,37.47
  Bottom 0.406: IC1.9 43.5,22.54 43.5,18.41 44.13,17.78 45.72,17.78 49.21,21.27 PROG.5
RX
  Top 0.406: R16.1 27.3,42.55 29.21,40.64 30.48,40.64 41.91,29.21 IC1.11
RX(USB)
  Top 0.406: IC2.12 14.61,37.47 19.68,42.55 R16.2
STAT-SCLK
  Top 0.406: R13.1 26.04,5.71 27.94,7.62 27.94,24.45 28.89,25.4 40.64,25.4 44.45,21.59 IC1.8 45.72,21.59 47.31,23.18 47.31,25.08 49.21,26.99 PROG.3
STATLED
  Top 0.406: STAT.A 1.58,5.88 1.75,5.71 R13.2
STEP-1
  Bottom 0.406: IC1.29 43.81,45.72 46.99,45.72 57.15,35.56 64.14,35.56 M2.7_1
STEP-2
  Top 0.406: IC1.14 46.67,35.24 50.48,35.24 54.29,31.43 54.29,19.68 56.2,17.78 61.59,17.78 63.5,15.88 M2.7_2
TX
  Top 0.406: R15.1 27.3,40.01 29.21,38.1 31.75,38.1 43.18,26.67 IC1.10
TX(USB)
  Top 0.406: IC2.10 R15.2
USBLED
  Top 0.406: LINK.A 2.38,31.59 6.67,27.3 R19.1
USBOSC1
  Top 0.406: IC2.2 21.27,19.68 22.23,18.73 22.23,15.02 X2.P$2 20.32,13.11 C8.1
USBOSC2
  Top 0.406: IC2.3 20.32,21.91 22.86,19.37 22.86,15.02 X2.P$1 24.77,13.11 C7.1
USBSTAT
  Top 0.406: R19.2 IC2.16
V+
  pour Top (isolate 0.61, rank 2, no thermals): 93.66,67.31 11.43,67.31 11.43,63.18 10.48,62.23 9.21,62.23 7.94,60.96 7.94,59.69 12.38,55.24 45.09,55.24 49.53,50.8 60.96,50.8 63.82,53.66 68.58,53.66 72.39,49.85 72.39,31.43 73.66,30.16 88.58,30.16 95.25,36.83 95.25,49.21 91.44,53.02 91.44,60.96 93.66,63.18
VBUS
  Top 0.61: USB.VBUS 7.63,15.57 8.89,16.83 8.89,20.64 8.06,21.47 D2.2
VIN  (via drill 0.5)
  other vias: 15.24,55.88 17.78,55.88 14.29,57.15 15.24,57.15 16.51,55.88 17.78,57.15 15.24,59.05 14.29,58.1 16.51,57.15 15.24,58.1 14.29,55.88 14.29,59.05
  pour Top (isolate 0.61, no thermals): 13.97,62.23 19.05,62.23 19.05,55.24 11.43,55.24 11.43,59.69
  pour Bottom (isolate 0.61, no thermals): 11.43,57.15 13.97,59.69 15.88,59.69 18.1,57.47 18.1,50.48 13.34,45.72 arc-180 10.16,49.53 11.43,50.8
VPIC
  Top 0.406: R18.2 22.64,23.5 19.37,23.5 18.41,22.54
  Top 0.61: D2.1 11.43,22.86 12.06,23.5 17.46,23.5 18.41,22.54 18.41,19.05 IC2.1 18.31,15.14 C5.1
VUSB
  Top 0.813: C6.2 12.38,25.08 IC2.17

### Text on the board
tPlace: 1 | 1 | 1 | Markings show the location of the potentiometers on the | Pololu boards depending on which chip they use. | Jumpers: | 1 2 3 | 1 | =8834 | =882x/498x | 1
tNames: Designed By | AstroEQ | Tom Carpenter | V4.8-PTH | (C) 2012-26 | Controller | 16M | IO3 / (TGT) | !ESTOP! | IO1 (SNAP) | GND | GPIO: / 5: +5V / 4: IO0 (HC) / 3: IO1 (SNAP) / 2: IO2 (RSVD) / 1: GND | 12M
Reference: This board design is for purchased AstroEQ controllers. | Due to the large number of surface mount components, this board / is not designed to be DIY-ed. | For DIY, use "AstroEQ PTH V4.8"